# Altium project Twintig-IMUs.PrjPcb
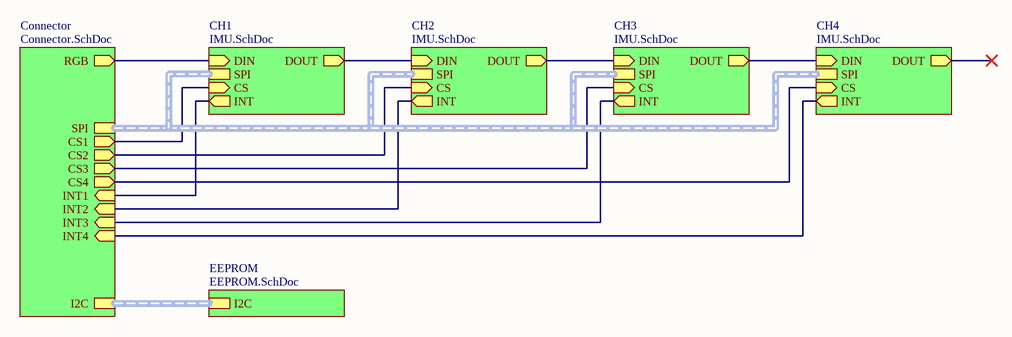
[diagram p0: Main.SchDoc]
Version: v1.0.7; Project: Twintig IMUs; Author: Seb Madgwick
4 sheets, 25 parts. Net scope: hierarchical (ports join the sheet entries above them; power ports are global).
Board file: Twintig-IMUs.PcbDoc
Sheets:
  Main.SchDoc
    Connector = Connector.SchDoc
    CH1 = IMU.SchDoc
    CH2 = IMU.SchDoc
    CH3 = IMU.SchDoc
    CH4 = IMU.SchDoc
    EEPROM = EEPROM.SchDoc

## Sheet Main.SchDoc
size A4; SheetNumber: 1; SheetTotal: 4

### Sub-sheets
CH1 = IMU.SchDoc: DIN (in), DOUT (out), SPI (harness SPI), CS (in), INT (out)
CH2 = IMU.SchDoc: DIN (in), DOUT (out), SPI (harness SPI), CS (in), INT (out)
CH3 = IMU.SchDoc: DIN (in), DOUT (out), SPI (harness SPI), CS (in), INT (out)
CH4 = IMU.SchDoc: DIN (in), DOUT (out), SPI (harness SPI), CS (in), INT (out)
Connector = Connector.SchDoc: SPI (harness SPI), RGB (out), I2C (harness I2C), INT1 (in), CS1 (out), INT2 (in), CS2 (out), INT3 (in), CS3 (out), INT4 (in), CS4 (out)
EEPROM = EEPROM.SchDoc: I2C (harness I2C)

### Nets
CS1: sheet Connector/CS1, sheet CH1/CS
CS2: sheet Connector/CS2, sheet CH2/CS
CS3: sheet Connector/CS3, sheet CH3/CS
CS4: sheet Connector/CS4, sheet CH4/CS
DOUT: sheet CH1/DOUT, sheet CH2/DIN
DOUT: sheet CH2/DOUT, sheet CH3/DIN  [a separate net that carries the same name]
DOUT: sheet CH3/DOUT, sheet CH4/DIN  [a separate net that carries the same name]
INT1: sheet Connector/INT1, sheet CH1/INT
INT2: sheet Connector/INT2, sheet CH2/INT
INT3: sheet Connector/INT3, sheet CH3/INT
INT4: sheet Connector/INT4, sheet CH4/INT
RGB: sheet Connector/RGB, sheet CH1/DIN

### Buses and harness runs
harness sheet CH1/SPI = sheet CH2/SPI = sheet CH3/SPI = sheet CH4/SPI = sheet Connector/SPI
harness sheet Connector/I2C = sheet EEPROM/I2C

### Notes on the sheet
- TITLE
- SIZE
- A4
- VARIANT
- PROJECT
- SHEET
- VERSION
- OF
- AUTHOR
- DATE

## Sheet Connector.SchDoc
size A4; SheetNumber: 2; SheetTotal: 4
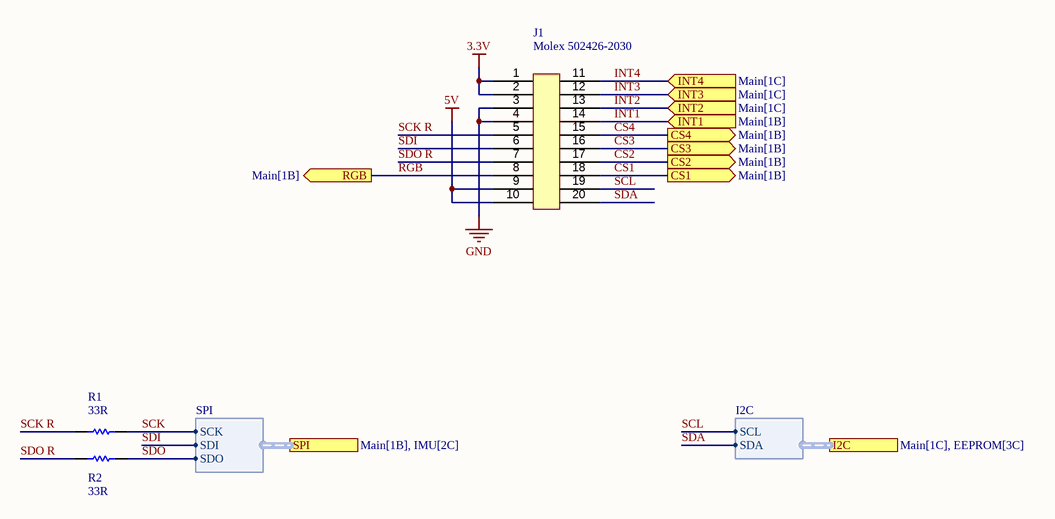
[diagram p1: Connector.SchDoc]

### Parts
J1  Molex 502426-2030  [Molex 502426-2030]
R1  33R  [Resistor 0201]
R2  33R  [Resistor 0201]

### Ports
CS1 (out, see Main[1B]), CS2 (out, see Main[1B]), CS3 (out, see Main[1B]), CS4 (out, see Main[1B]), I2C (harness I2C, see Main[1C], EEPROM[3C]), INT1 (in, see Main[1B]), INT2 (in, see Main[1C]), INT3 (in, see Main[1C]), INT4 (in, see Main[1C]), RGB (out, see Main[1B]), SPI (harness SPI, see Main[1B], IMU[2C])

### Harnesses
SPI: SCK, SDI, SDO
I2C: SCL, SDA

### Nets
3.3V: J1.1 J1.2
5V: J1.9 J1.10
GND: J1.3 J1.4
CS1: J1.18 ; port CS1
CS2: J1.17 ; port CS2
CS3: J1.16 ; port CS3
CS4: J1.15 ; port CS4
INT1: J1.14 ; port INT1
INT2: J1.13 ; port INT2
INT3: J1.12 ; port INT3
INT4: J1.11 ; port INT4
RGB: J1.8 ; port RGB
SCK: R1.2 ; port SPI.SCK
SCK R: J1.5 R1.1
SCL: J1.19 ; port I2C.SCL
SDA: J1.20
SDI: J1.6 ; port SPI.SDI
SDO: R2.2 ; port SPI.SDO
SDO R: J1.7 R2.1

### Notes on the sheet
- TITLE
- SIZE
- A4
- VARIANT
- PROJECT
- SHEET
- VERSION
- OF
- AUTHOR
- DATE

### Library data of the parts
R1 R2 = Resistor

## Sheet IMU.SchDoc
size A4; SheetNumber: 4; SheetTotal: 4
Used 4 times, as channels CH1, CH2, CH3, CH4. Parts and nets are listed once, with the designators drawn on the sheet.
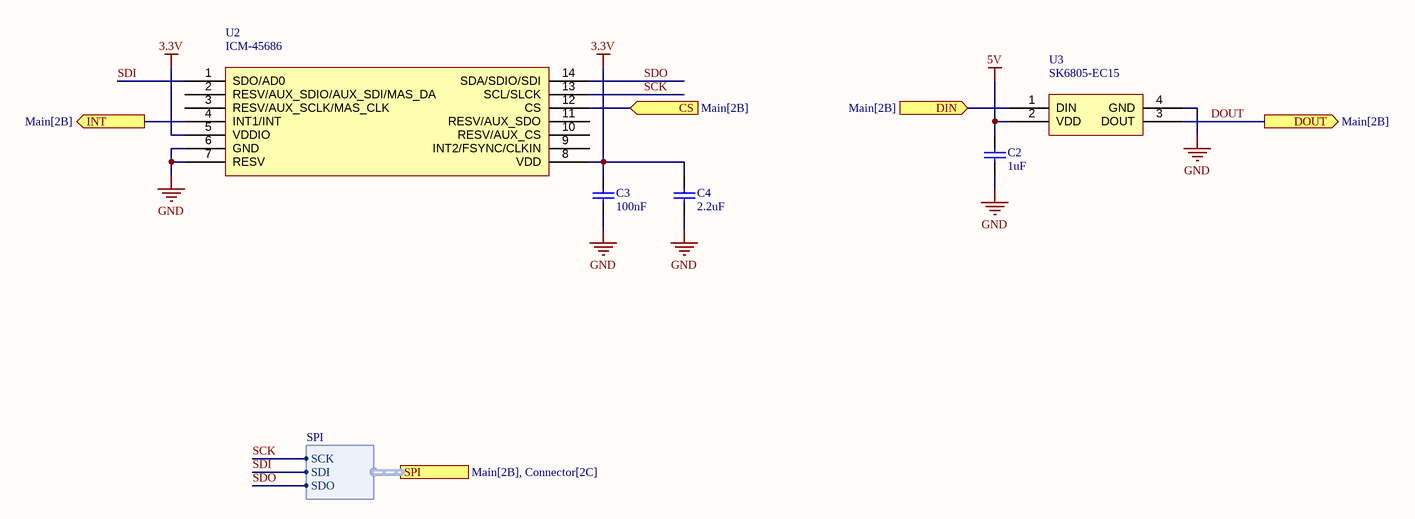
[diagram p2: IMU.SchDoc]

### Parts
C2  1uF  [Capacitor 0201]
C3  100nF  [Capacitor 0201]
C4  2.2uF  [Capacitor 0201]
U2  ICM-45686  [ICM-45686]
U3  SK6805-EC15  [SK6805-EC15]

### Ports
CS (in, see Main[2B]), DIN (in, see Main[2B]), DOUT (out, see Main[2B]), INT (out, see Main[2B]), SPI (harness SPI, see Main[2B], Connector[2C])

### Harnesses
SPI: SCK, SDI, SDO

### Nets
3.3V: C3.2 C4.2 U2.5(VDDIO) U2.8(VDD)
5V: C2.2 U3.2(VDD)
GND: C2.1 C3.1 C4.1 U2.6(GND) U2.7(RESV) U3.4(GND)
CS: U2.12(CS) ; port CS
DIN: U3.1(DIN) ; port DIN
DOUT: U3.3(DOUT) ; port DOUT
INT: U2.4(INT1/INT) ; port INT
SCK: U2.13(SCL/SLCK) ; port SPI.SCK
SDI: U2.1(SDO/AD0) ; port SPI.SDI
SDO: U2.14(SDA/SDIO/SDI) ; port SPI.SDO

Not connected (* = marked no-connect by the designer): U2 2(RESV/AUX_SDIO/AUX_SDI/MAS_DA) 3(RESV/AUX_SCLK/MAS_CLK) 9(INT2/FSYNC/CLKIN) 10(RESV/AUX_CS) 11(RESV/AUX_SDO)

### Channels
CH1: designators end in _CH1; ports CS=CS1 DIN=RGB DOUT=DOUT INT=INT1
CH2: designators end in _CH2; ports CS=CS2 DIN=DOUT DOUT=DOUT INT=INT2
CH3: designators end in _CH3; ports CS=CS3 DIN=DOUT DOUT=DOUT INT=INT3
CH4: designators end in _CH4; ports CS=CS4 DIN=DOUT DOUT=DOUT_CH4 INT=INT4

### Notes on the sheet
- TITLE
- SIZE
- A4
- VARIANT
- PROJECT
- SHEET
- VERSION
- OF
- AUTHOR
- DATE

### Library data of the parts
C2-C4 = Capacitor

## Sheet EEPROM.SchDoc
size A4; SheetNumber: 3; SheetTotal: 4
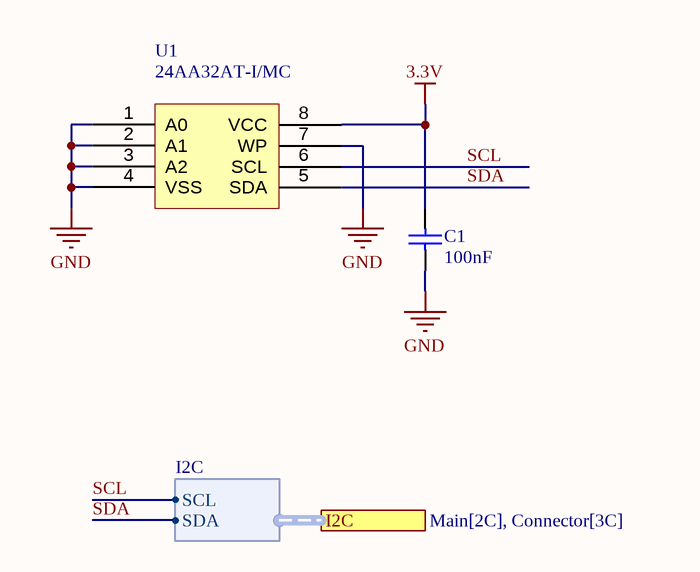
[diagram p3: EEPROM.SchDoc]

### Parts
C1  100nF  [Capacitor 0201]
U1  24AA32AT-I/MC  [TDFN-8 2x3mm]

### Ports
I2C (harness I2C, see Main[2C], Connector[3C])

### Harnesses
I2C: SCL, SDA

### Nets
3.3V: C1.2 U1.8(VCC)
GND: C1.1 U1.1(A0) U1.2(A1) U1.3(A2) U1.4(VSS) U1.7(WP)
SCL: U1.6(SCL) ; port I2C.SCL
SDA: U1.5(SDA)

### Notes on the sheet
- TITLE
- SIZE
- A4
- VARIANT
- PROJECT
- SHEET
- VERSION
- OF
- AUTHOR
- DATE

### Library data of the parts
C1 = Capacitor
U1 = 24AA32A

## Nets that join several sheets
3.3V: Connector (J1.1 J1.2), CH1 (C3_CH1.2 C4_CH1.2 U2_CH1.5 U2_CH1.8), CH2 (C3_CH2.2 C4_CH2.2 U2_CH2.5 U2_CH2.8), CH3 (C3_CH3.2 C4_CH3.2 U2_CH3.5 U2_CH3.8), CH4 (C3_CH4.2 C4_CH4.2 U2_CH4.5 U2_CH4.8), EEPROM (C1.2 U1.8)
5V: Connector (J1.9 J1.10), CH1 (C2_CH1.2 U3_CH1.2), CH2 (C2_CH2.2 U3_CH2.2), CH3 (C2_CH3.2 U3_CH3.2), CH4 (C2_CH4.2 U3_CH4.2)
GND: Connector (J1.3 J1.4), CH1 (6 pins), CH2 (6 pins), CH3 (6 pins), CH4 (6 pins), EEPROM (6 pins)
CS1: Connector (J1.18), CH1 (U2_CH1.12)
CS2: Connector (J1.17), CH2 (U2_CH2.12)
CS3: Connector (J1.16), CH3 (U2_CH3.12)
CS4: Connector (J1.15), CH4 (U2_CH4.12)
DOUT: CH1 (U3_CH1.3), CH2 (U3_CH2.1)
DOUT: CH2 (U3_CH2.3), CH3 (U3_CH3.1)
DOUT: CH3 (U3_CH3.3), CH4 (U3_CH4.1)
INT1: Connector (J1.14), CH1 (U2_CH1.4)
INT2: Connector (J1.13), CH2 (U2_CH2.4)
INT3: Connector (J1.12), CH3 (U2_CH3.4)
INT4: Connector (J1.11), CH4 (U2_CH4.4)
RGB: Connector (J1.8), CH1 (U3_CH1.1)
SCK: Connector (R1.2), CH1 (U2_CH1.13), CH2 (U2_CH2.13), CH3 (U2_CH3.13), CH4 (U2_CH4.13)
SCL: Connector (J1.19), EEPROM (U1.6)
SDI: Connector (J1.6), CH1 (U2_CH1.1), CH2 (U2_CH2.1), CH3 (U2_CH3.1), CH4 (U2_CH4.1)
SDO: Connector (R2.2), CH1 (U2_CH1.14), CH2 (U2_CH2.14), CH3 (U2_CH3.14), CH4 (U2_CH4.14)